# EAGLE design wsbd v2 (EAGLE 6.6.0)
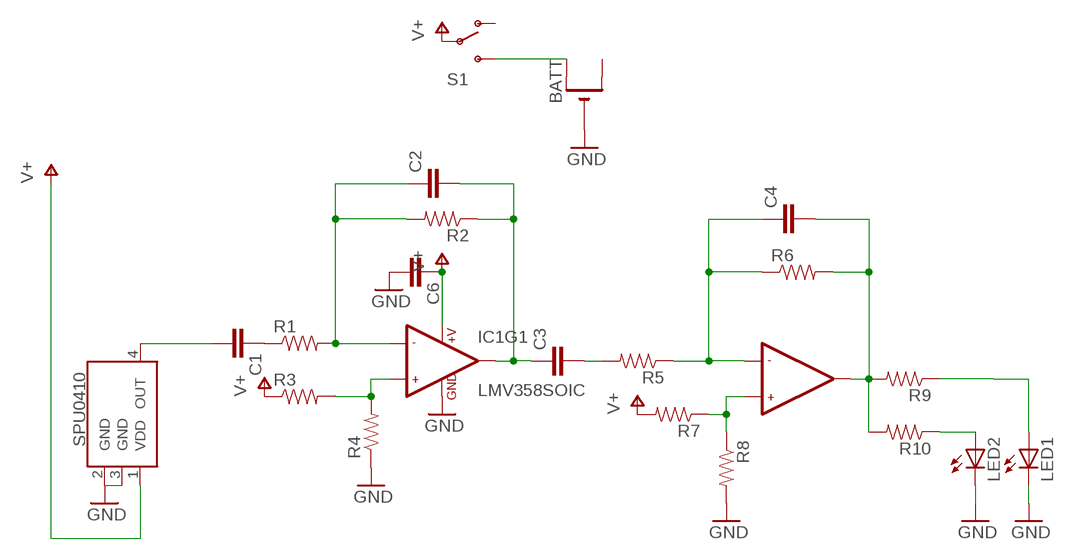
[diagram p0: schematic, sheet 1]

## Parts
BATT  CR2032MPD1  [CR2032-THRU]
C1  CAP0805  [0805]
C2  CAP0805  [0805]
C3  CAP0805  [0805]
C4  CAP0805  [0805]
C6  CAP0805  [0805]
IC1  LMV358SOIC  [SO08]
LED1  LEDCHIP-LED0805  [CHIP-LED0805]
LED2  LEDCHIP-LED0805  [CHIP-LED0805]
R1  RESISTOR0805-RES  [0805]
R2  RESISTOR0805-RES  [0805]
R3  RESISTOR0805-RES  [0805]
R4  RESISTOR0805-RES  [0805]
R5  RESISTOR0805-RES  [0805]
R6  RESISTOR0805-RES  [0805]
R7  RESISTOR0805-RES  [0805]
R8  RESISTOR0805-RES  [0805]
R9  RESISTOR0805-RES  [0805]
R10  RESISTOR0805-RES  [0805]
S1  SWITCH-SPDT-SMD-A  [SWITCH-SPST-SMD-A]
U$1  SPU0410  [SPSERIES1]

## Nets
GND: BATT.GND(-) C6.2 IC1.4(GND) LED1.C LED2.C R4.1 R8.2 U$1.2(GND) U$1.3(GND)
N$1: C3.2 R5.2
N$2: C1.1 R1.1
N$3: C2.1 IC1.2(-IN1) R1.2 R2.2
N$4: IC1.3(+IN1) R3.2 R4.2
N$5: C2.2 C3.1 IC1.1(OUT1) R2.1
N$6: BATT.+1(+) S1.3(S)
N$7: IC1.5(+IN2) R7.1 R8.1
N$8: C4.1 IC1.6(-IN2) R5.1 R6.1
N$10: C1.2 U$1.4(OUT)
N$12: LED1.A R9.1
N$13: LED2.A R10.1
N$14: C4.2 IC1.7(OUT2) R6.2 R9.2 R10.2
V+: C6.1 IC1.8(+V) R3.1 R7.2 S1.2(P) U$1.1(VDD)
Unconnected: BATT.+2(+1) S1.1(O)

## Library data of the parts
BATT = mylibrary:CR2032
C1-C4 C6 = SparkFun-Capacitors:CAP: Capacitor Standard 0603 ceramic capacitor, and 0.1" leaded capacitor.
IC1 = SparkFun-AnalogIC:LMV358: Jellybean rail-to-rail output op-amp; PROD_ID: IC-09657
LED1 LED2 = adafruit:LED: LED OSRAM: - CHIPLED LG R971, LG N971, LY N971, LG Q971, LY Q971, LO R971, LY R971 LH N974, LH R974 LS Q976, LO Q976, LY Q976 LO Q996 - Hyper CHIPLED LW Q18S LB Q993, LB Q99A, LB R99A - SideLED LS A670, LO A670, LY A670, LG A670, LP A670 LB A673, LV A673, LT A673, LW A673 LH A674 LY A675 LS A676, LA A676, LO A676, LY A676, LW A676 LS A679, LY A679, LG A679 - Hyper Micro SIDELED® LS Y876, LA Y876, LO Y876, LY Y876 LT Y87S - SmartLED LW L88C, LW L88S LB L89C, LB L89S, LG L890 LS L89K, LO L89K, LY L89K LS L896, LA L896, LO L896, LY L896 - TOPLED LS T670, LO T670, LY T670, LG T670, LP T670 LSG T670, LSP T670, LSY T670, LOP T670, LYG T670 LG T671, LOG T671, LSG T671 LB T673, LV T673, LT T673, LW T673 LH T674 LS T676, LA T676, LO T676, LY T676, LB T676, LH T676, LSB T676, LW T676 LB T67C, LV T67C, LT T67C, LS T67K, LO T67K, LY T67K, LW E67C LS E67B, LA E67B, LO E67B, LY E67B, LB E67C, LV E67C, LT E67C LW T67C LS T679, LY T679, LG T679 LS T770, LO T770, LY T770, LG T770, LP T770 LB T773, LV T773, LT T773, LW T773 LH T774 LS E675, LA E675, LY E675, LS T675 LS T776, LA T776, LO T776, LY T776, LB T776 LHGB T686 LT T68C, LB T68C - Hyper Mini TOPLED® LB M676 - Mini TOPLED Santana® LG M470 LS M47K, LO M47K, LY M47K Source: http://www.osram.convergy.de/
R1-R10 = SparkFun-Resistors:RESISTOR: Resistor Basic schematic elements and footprints for 0603, 1206, and PTH resistors.
S1 = SparkFun-Electromechanical:SWITCH-SPDT: SPDT Switch Simple slide switch, Spark Fun Electronics SKU : COM-00102 DPDT SMT slide switch, AYZ0202, SWCH-08179
U$1 = mylibrary:SPU0410: Knowles MEMS Microphone SPU and SPD

## Board
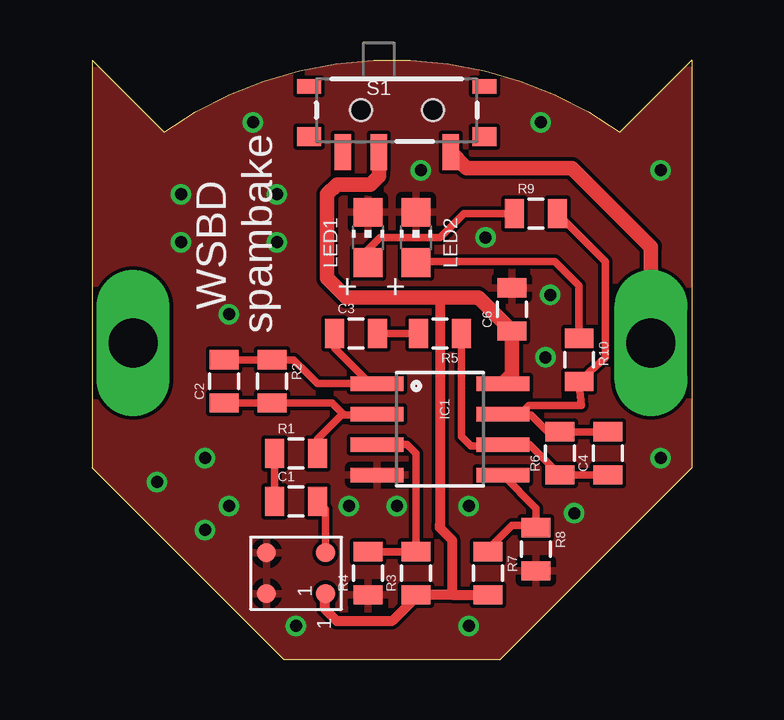
[diagram p1: board, top side]
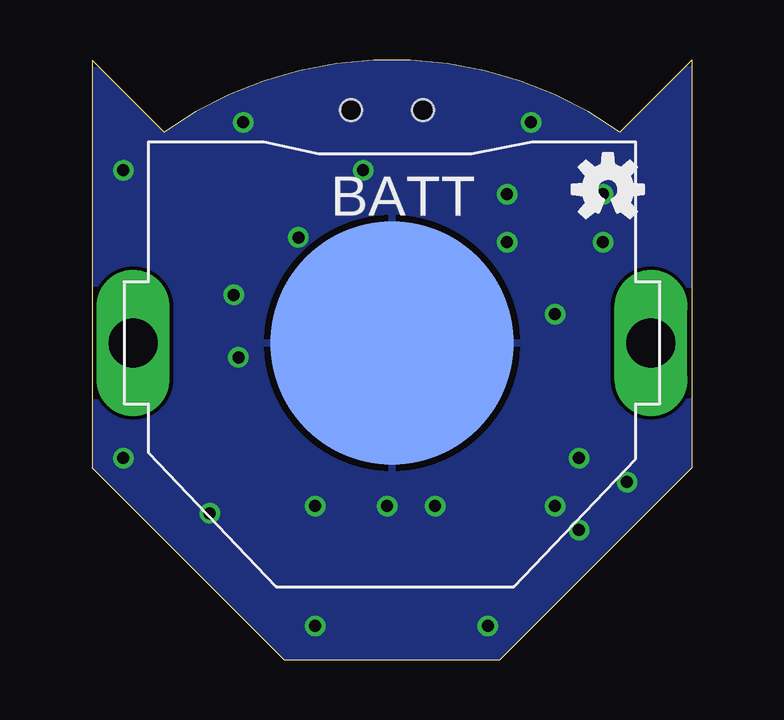
[diagram p2: board, bottom side, seen from below]

Size 25 x 25 mm. Coordinates in mm from the lower left corner, seen from the top.
Outline: 17,0 8,0 0,8 0,9.6 0,16.5 0,25 3,22 arc-70 22,22 25,25 25,16.6 25,9.6 25,8 17,0
Copper layers (1*16): Top 0.0356mm / dielectric 1.5011mm / Bottom 0.0356mm
Design rules "LaenPCBOrder *": minimum track width 6mil, minimum drill 13mil, track to track 6mil, track to pad 6mil, pad to pad 6mil, via to via 6mil, smd to smd 6mil, copper to edge 1mil, drill to drill 6mil, minimum pad ring 7mil, minimum via ring 7mil, stop-mask expansion 3mil, vias tented up to drill 20mil, thermal gap 10mil

### Footprints (pad centres in the part's own frame; a part is rotated, then mirrored left to right if it is on the bottom)
CR2032-THRU = drill 2.032 pad 3.048 long: +1 -10.795,0; +2 10.795,0 | smd 10.16 x 10.16: GND 0,0
0805 = smd 0.8 x 1.2: 1 -0.9,0; 2 0.9,0
SO08 = smd 0.61 x 2.21: 1 -1.905,-2.616; 2 -0.635,-2.616; 3 0.635,-2.616; 4 1.905,-2.616; 5 1.905,2.616; 6 0.635,2.616; 7 -0.635,2.616; 8 -1.905,2.616
CHIP-LED0805 = smd 1.2 x 1.2: A 0,-1.05; C 0,1.05
SWITCH-SPST-SMD-A = smd 0.7 x 1.5: 1 -2.25,-1.75; 2 -0.75,-1.75; 3 2.25,-1.75 | smd 1 x 0.6: GND1 -3.65,1; GND3 3.65,1 | smd 1 x 0.8: GND2 -3.65,-1.1; GND4 3.65,-1.1 | hole 0.9: -1.5,0; 1.5,0
SPSERIES1 = smd 0.8 x 0.8: 1 0.85,1.23; 2 0.85,-1.23; 3 -0.85,-1.23; 4 -0.85,1.23

### Placement (x,y rotation side)
BATT  12.5,13.2 0 bottom
C1  8.5,6.6 0 top
C2  5.5,11.6 90 top
C3  11,13.6 0 top
C4  21.5,8.6 90 top
C6  17.5,14.6 90 top
IC1  14.5,9.6 270 top
LED1  11.5,17.6 0 top
LED2  13.5,17.6 0 top
R1  8.5,8.6 0 top
R2  7.5,11.6 270 top
R3  13.5,3.6 90 top
R4  11.5,3.6 90 top
R5  14.5,13.6 180 top
R6  19.5,8.6 90 top
R7  16.5,3.6 270 top
R8  18.5,4.6 270 top
R9  18.5,18.6 0 top
R10  20.3,12.5 270 top
S1  12.7,22.9 0 top
U$1  8.5,3.6 270 top
U$2  [OSHW-LOGO-S]  3.5,19.6 0 bottom

### Tracks (layer width: path | path; a pad name or v marks a point on that pad's centre or on a via)
GND  (via drill 0.5)
  other vias: 19.1,15.2 10.7,6.4 12.7,6.4 15.7,6.4 7.7,19.4 7.7,17.4 3.7,19.4 3.7,17.4 4.7,8.4 5.7,6.4 18.7,22.4 6.7,22.4 23.7,20.4 23.7,8.4 15.7,1.4 2.7,7.4 4.7,5.4 20.1,6.1 8.5,1.4 18.9,12.6 13.7,20.4 16.4,17.6 5.7,14.4
  pour Top: -2.5,-2.4 27.5,-2.4 27.5,29.6 -2.5,29.6
  pour Bottom: -1.5,-4.4 -1.5,34.6 26.5,34.6 26.5,-4.4
N$1
  Top 0.305: C3.2 R5.2
N$2
  Top 0.305: C1.1 R1.1
N$3
  Top 0.305: R1.2 9.4,9.2 10.4,10.2 10.5,10.2 | 10.5,10.2 11.85,10.2 IC1.2 | 10.5,10.2 10,10.7 R2.2 C2.1
N$4
  Top 0.305: R4.2 R3.2 13.5,8.6 13.14,8.96 IC1.3
N$5
  Top 0.305: C2.2 R2.1 8.4,12.5 9,11.9 9.4,11.5 IC1.1 11.79,11.6 11.5,11.6 10.1,13 C3.1
N$6
  Top 0.61: BATT.+1 23.3,17.2 20,20.5 15.6,20.5 S1.3
N$7
  Top 0.305: R7.1 16.5,4.6 17.5,5.6 18.4,5.6 R8.1 18.5,6.31 IC1.5
N$8
  Top 0.305: R5.1 15.4,9.3 15.8,8.9 17.05,8.9 IC1.6 18.23,8.96 R6.1 C4.1
N$10
  Top 0.305: U$1.4 9.73,6.27 C1.2
N$12
  Top 0.305: R9.1 15.5,18.6 14.5,17.6 12,17.6 11.5,17.1 LED1.A
N$13
  Top 0.305: R10.1 20.3,15.6 19.3,16.6 13.55,16.6 LED2.A
N$14
  Top 0.305: C4.2 R6.2 19,9.5 18.3,10.2 17.8,10.2 | 17.8,10.2 17.15,10.2 IC1.7 | 17.8,10.2 18.2,10.6 20.4,10.6 R10.2 21.4,12.6 21.4,16.6 R9.2
V+
  Top 0.406: 14.5,15.1 14.5,5.6 14.5,5.5 15,5 15,2.7 | 15,2.7 R7.2 | 15,2.7 R3.1 13.5,2.6 12.5,1.6 10.5,1.6 10.2,1.6 9.7,2.1 9.7,2.72 U$1.1
  Top 0.61: S1.2 11.95,20.15 11.6,19.8 10.3,19.8 10.2,19.8 9.8,19.4 9.8,15.9 10.6,15.1 14.5,15.1 16.1,15.1 C6.1 17.5,11.89 IC1.8

### Text on the board
tPlace: WSBD / spambake